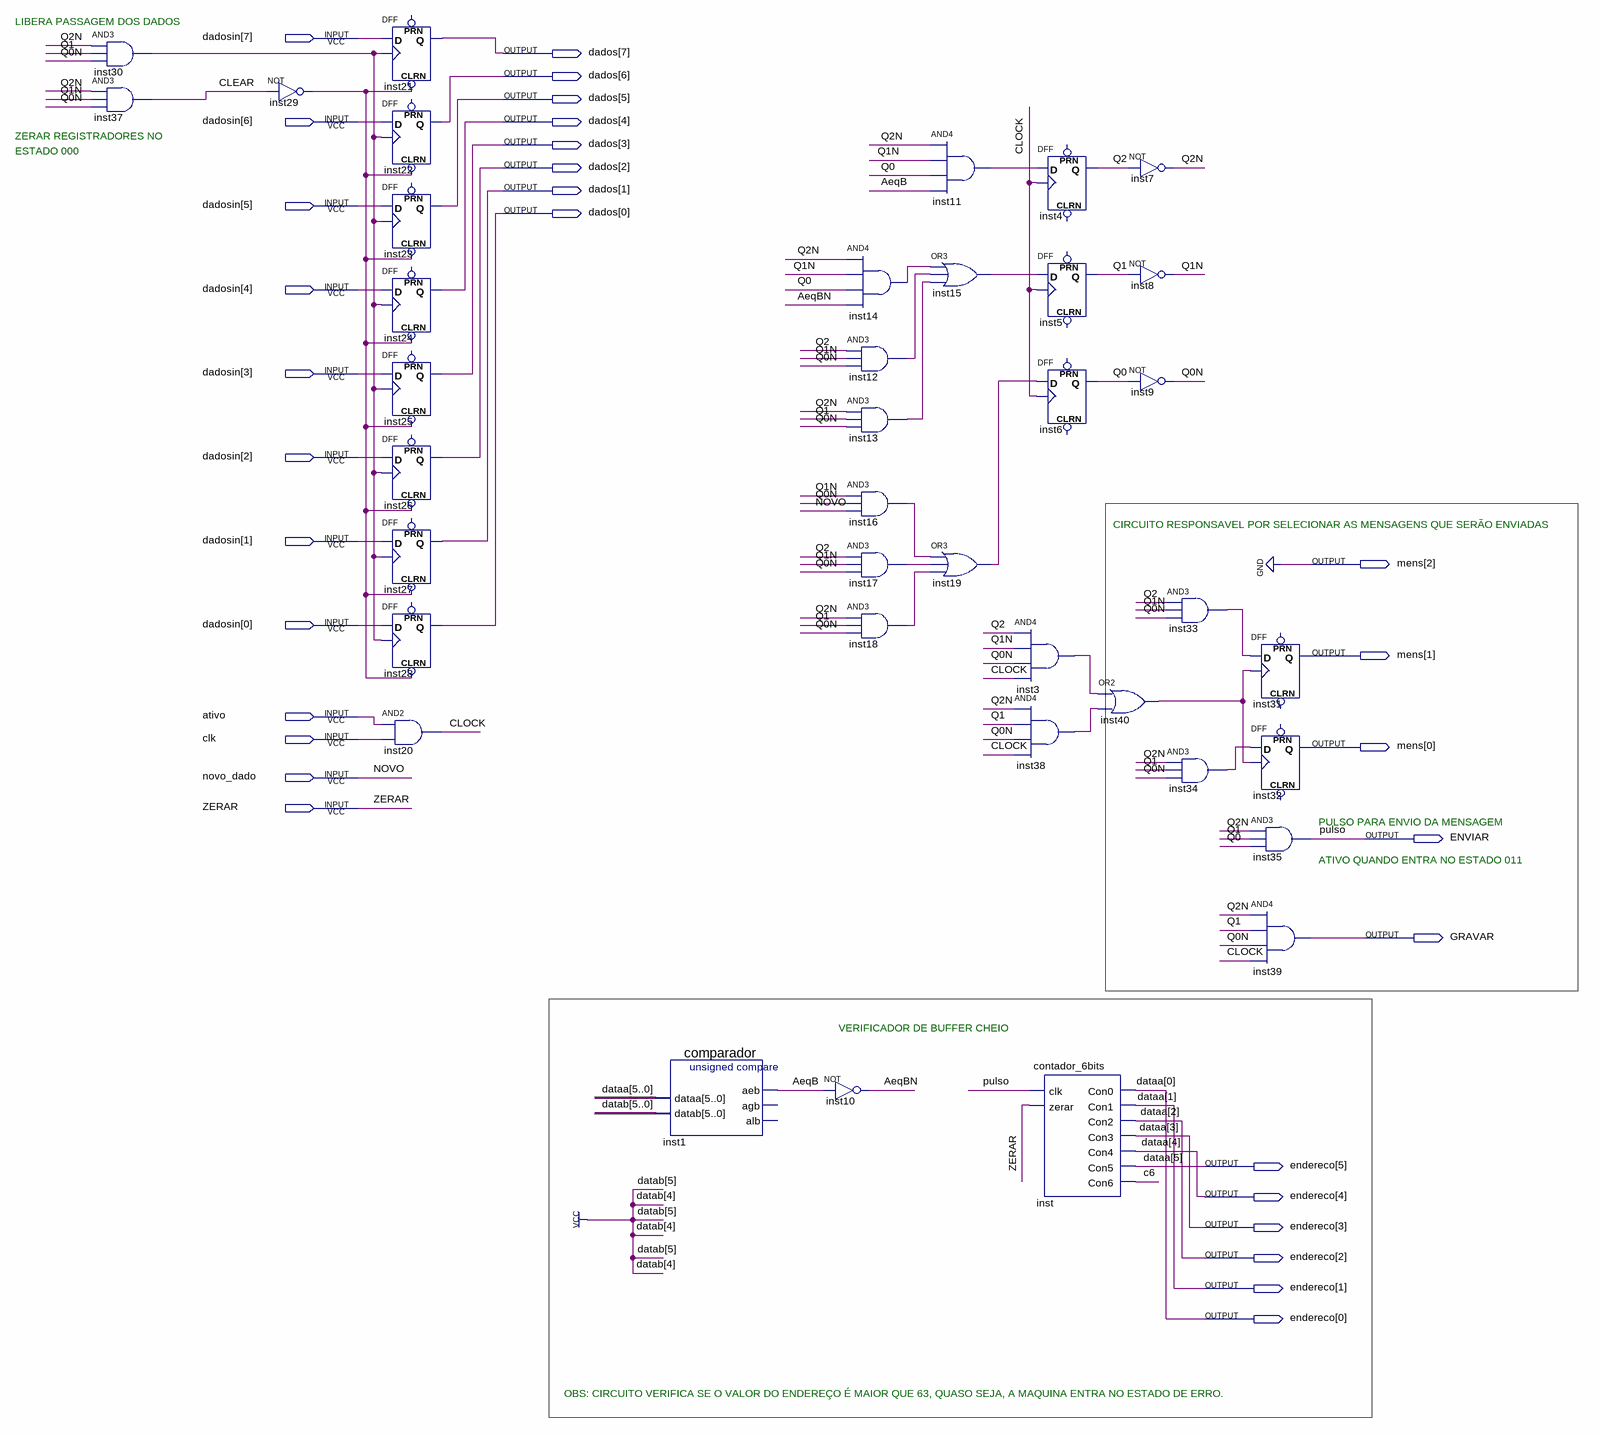
[diagram p0: schematic sheet]
// Quartus schematic mef_gravacao.bdf as structural Verilog: 39 symbols, 31 pins
module mef_gravacao (
  input  [7:0] dadosin,
  input  ativo,
  input  clk,
  input  novo_dado,
  input  ZERAR,
  output [7:0] dados,
  output [2:0] mens,
  output ENVIAR,
  output GRAVAR,
  output [5:0] endereco
);

  wire AeqB, AeqBN, c6, CLEAR, CLOCK, inst3_out, inst11_out, inst12_out, inst13_out, inst14_out, inst15_out,
       inst16_out, inst17_out, inst18_out, inst19_out, inst29_out, inst30_out, inst33_out, inst34_out,
       inst38_out, inst40_out, Q0, Q0N, Q1, Q1N, Q2, Q2N;
  wire [3:0] datab;

  and inst30 (inst30_out, Q2N, Q1, Q0N);
  and inst37 (CLEAR, Q2N, Q1N, Q0N);
  not inst29 (inst29_out, CLEAR);
  DFF inst21 (.CLRN(inst29_out), .CLK(inst30_out), .D(dadosin[7]), .Q(dados[7]));  // open: PRN
  DFF inst22 (.CLRN(inst29_out), .CLK(inst30_out), .D(dadosin[6]), .Q(dados[6]));  // open: PRN
  DFF inst23 (.CLRN(inst29_out), .CLK(inst30_out), .D(dadosin[5]), .Q(dados[5]));  // open: PRN
  DFF inst24 (.CLRN(inst29_out), .CLK(inst30_out), .D(dadosin[4]), .Q(dados[4]));  // open: PRN
  DFF inst25 (.CLRN(inst29_out), .CLK(inst30_out), .D(dadosin[3]), .Q(dados[3]));  // open: PRN
  DFF inst26 (.CLRN(inst29_out), .CLK(inst30_out), .D(dadosin[2]), .Q(dados[2]));  // open: PRN
  DFF inst27 (.CLRN(inst29_out), .CLK(inst30_out), .D(dadosin[1]), .Q(dados[1]));  // open: PRN
  DFF inst28 (.CLRN(inst29_out), .CLK(inst30_out), .D(dadosin[0]), .Q(dados[0]));  // open: PRN
  and inst20 (CLOCK, ativo, clk);
  comparador inst1 (.dataa(endereco), .datab({2'b11, datab}), .aeb(AeqB));  // open: agb, alb
  not inst10 (AeqBN, AeqB);
  and inst14 (inst14_out, Q2N, Q1N, Q0, AeqBN);
  and inst12 (inst12_out, Q2, Q1N, Q0N);
  and inst13 (inst13_out, Q2N, Q1, Q0N);
  and inst16 (inst16_out, Q1N, Q0N, novo_dado);
  and inst17 (inst17_out, Q2, Q1N, Q0N);
  and inst18 (inst18_out, Q2N, Q1, Q0N);
  and inst11 (inst11_out, Q2N, Q1N, Q0, AeqB);
  or inst15 (inst15_out, inst14_out, inst12_out, inst13_out);
  or inst19 (inst19_out, inst16_out, inst17_out, inst18_out);
  DFF inst4 (.CLK(CLOCK), .D(inst11_out), .Q(Q2));  // open: CLRN, PRN
  DFF inst5 (.CLK(CLOCK), .D(inst15_out), .Q(Q1));  // open: CLRN, PRN
  DFF inst6 (.CLK(CLOCK), .D(inst19_out), .Q(Q0));  // open: CLRN, PRN
  and inst3 (inst3_out, Q2, Q1N, Q0N, CLOCK);
  and inst38 (inst38_out, Q2N, Q1, Q0N, CLOCK);
  contador_6bits inst (
    .clk(ENVIAR), .zerar(ZERAR), .Con0(endereco[0]), .Con1(endereco[1]), .Con2(endereco[2]),
    .Con3(endereco[3]), .Con4(endereco[4]), .Con5(endereco[5]), .Con6(c6));
  not inst7 (Q2N, Q2);
  not inst8 (Q1N, Q1);
  not inst9 (Q0N, Q0);
  or inst40 (inst40_out, inst3_out, inst38_out);
  and inst33 (inst33_out, Q2, Q1N, Q0N);
  and inst34 (inst34_out, Q2N, Q1, Q0N);
  DFF inst31 (.CLK(inst40_out), .D(inst33_out), .Q(mens[1]));  // open: CLRN, PRN
  DFF inst32 (.CLK(inst40_out), .D(inst34_out), .Q(mens[0]));  // open: CLRN, PRN
  and inst35 (ENVIAR, Q2N, Q1, Q0);
  and inst39 (GRAVAR, Q2N, Q1, Q0N, CLOCK);

  assign mens[2] = 1'b0;

  // Other names for the same wires on the sheet: dataa[5:0] = endereco; NOVO = novo_dado; pulso = ENVIAR

  // Notes on the sheet:
  //   LIBERA PASSAGEM DOS DADOS
  //   ZERAR REGISTRADORES NO
  //   ESTADO 000
  //   CIRCUITO RESPONSAVEL POR SELECIONAR AS MENSAGENS QUE SERÃO ENVIADAS
  //   PULSO PARA ENVIO DA MENSAGEM
  //   ATIVO QUANDO ENTRA NO ESTADO 011
  //   VERIFICADOR DE BUFFER CHEIO
  //   OBS: CIRCUITO VERIFICA SE O VALOR DO ENDEREÇO É MAIOR QUE 63, QUASO SEJA, A MAQUINA ENTRA NO ESTADO DE ERRO.
endmodule
